# Altium project POWER.PRJPCB
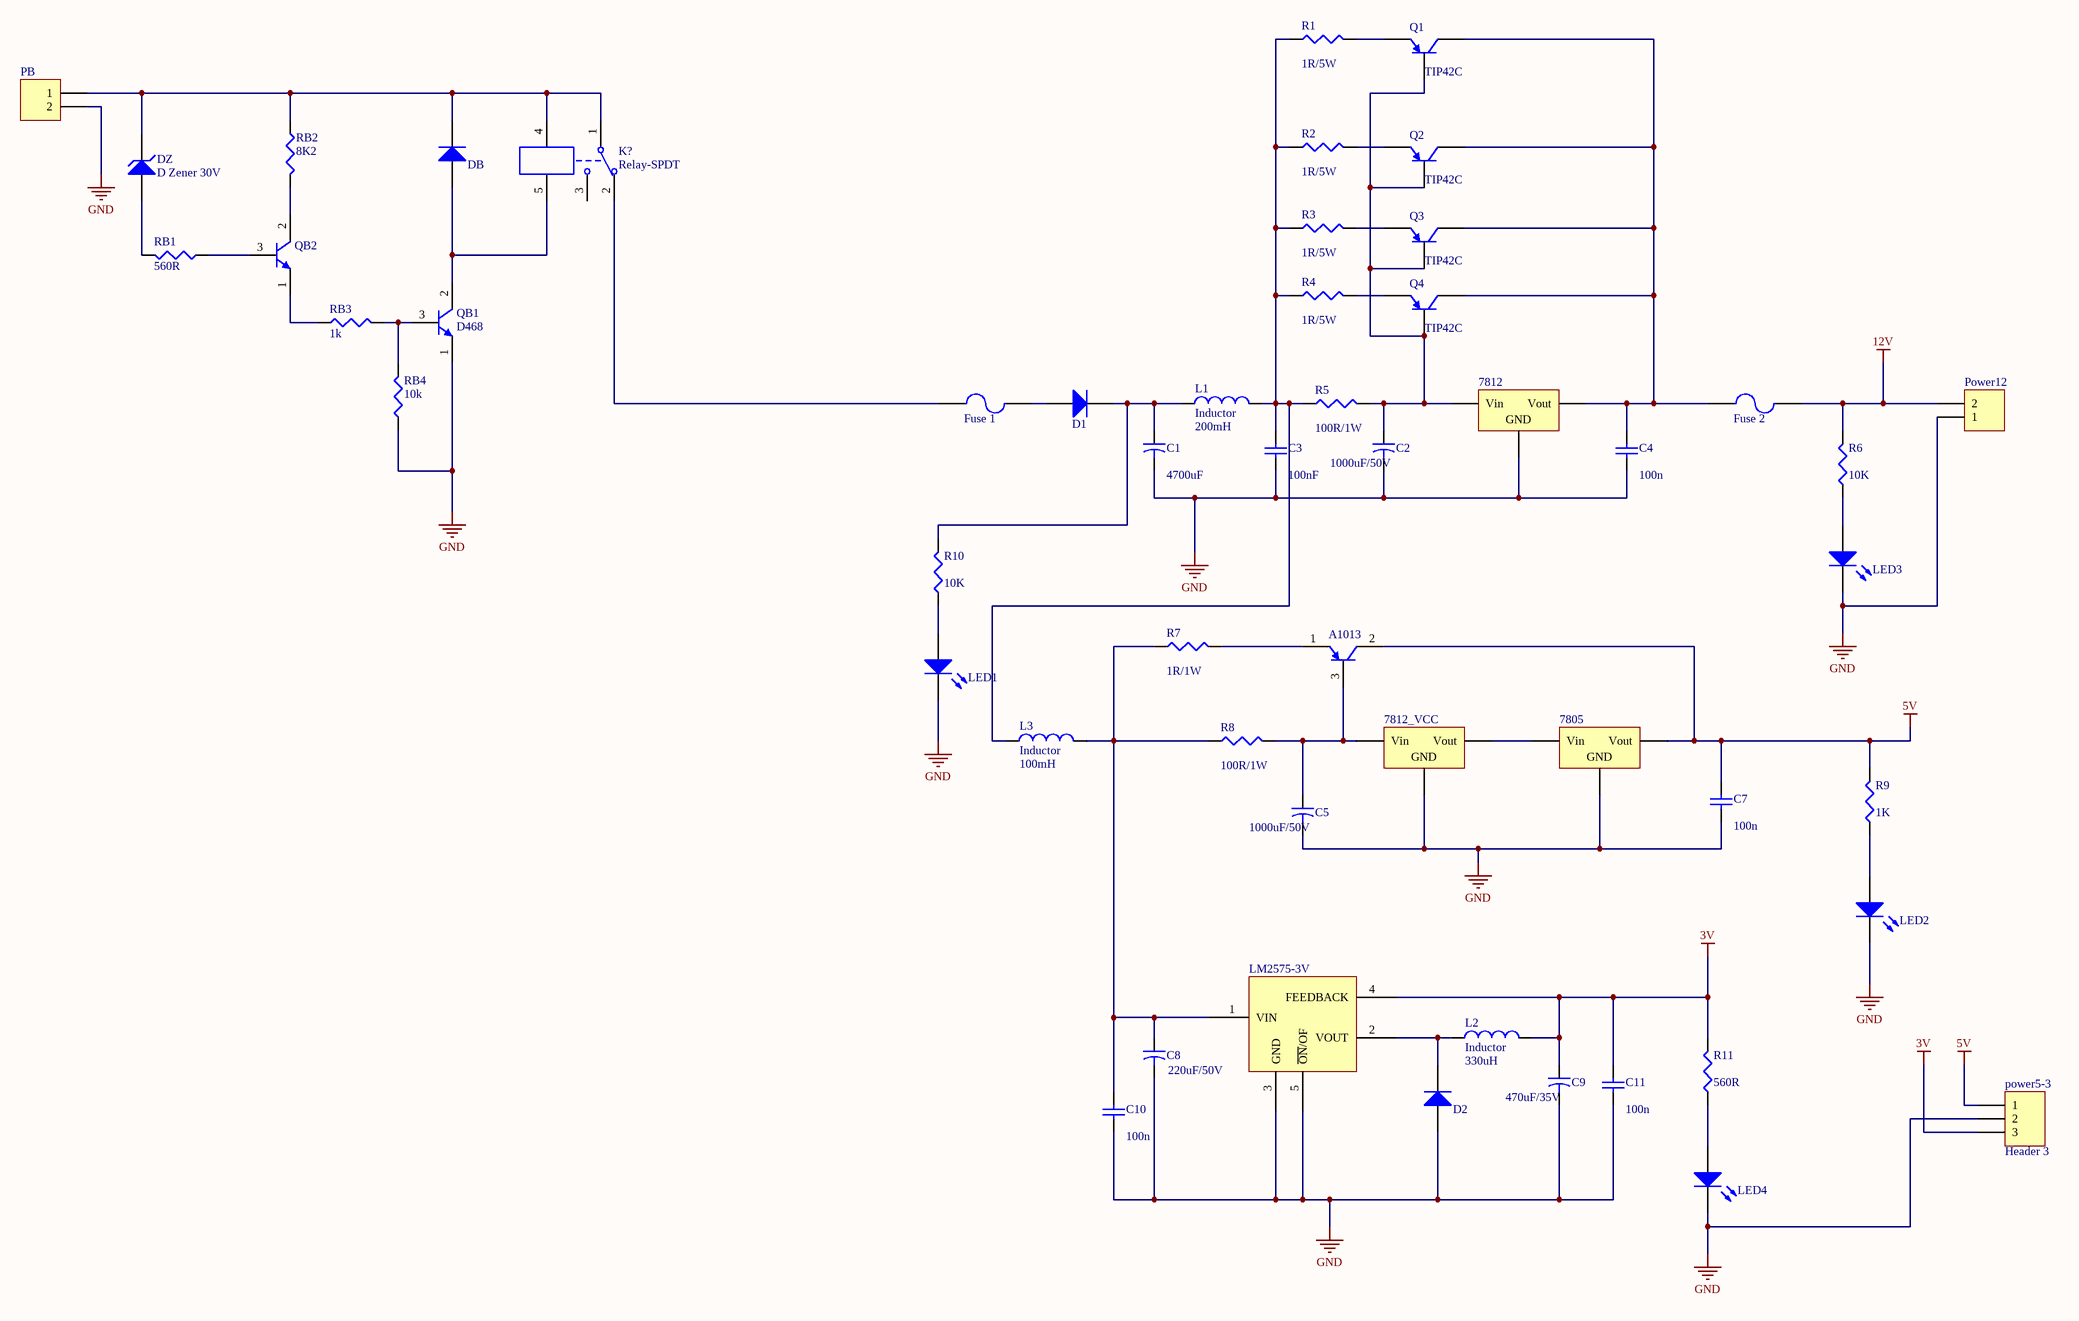
[diagram p0: power.SchDoc]
1 sheet, 53 parts. Net scope: global (net labels, ports and power ports of the same name join across sheets).
Board file: power.PcbDoc

## Sheet power.SchDoc
size A2

### Parts
7805  Volt Reg  [78xx]  (value not drawn)
7812  Volt Reg  [78xx_NO]  (value not drawn)
7812_VCC  Volt Reg  [78xx]  (value not drawn)
A1013  PNP  [D468/A1013]  (value not drawn)
C1  value 4700uF  [Tu 4700u/35V]  (hidden comment: Cap2)
C2  value 1000uF/50V  [Tu 1000u/50V]  (hidden comment: Cap2)
C3  value 100nF  [tu_gom]  (hidden comment: Cap Semi)
C4  value 100n  [tu_gom]  (hidden comment: Cap Semi)
C5  value 1000uF/50V  [Tu 1000u/50V]  (hidden comment: Cap2)
C7  value 100n  [tu_gom]  (hidden comment: Cap Semi)
C8  value 220uF/50V  [TU 220uF/50V]  (hidden comment: Cap2)
C9  value 470uF/35V  [TU 470uF/50V]  (hidden comment: Cap2)
C10  value 100n  [tu_gom]  (hidden comment: Cap Semi)
C11  value 100n  [tu_gom]  (hidden comment: Cap Semi)
D1  Diode  [D_10A]  (value not drawn)
D2  Diode  [D_1A]  (value not drawn)
DB  Diode  [D_1A]  (value not drawn)
DZ  D Zener 30V  [D_1A]
F1  Fuse 1  [FUSE_10A]
F2  Fuse 2  [FUSE_10A]
K?  Relay-SPDT  [Role 12V]
L1  Inductor  value 200mH  [Cuon cam to]
L2  Inductor  value 330uH  [R_Nor]
L3  Inductor  value 100mH  [Cuon cam nho]
LED1  LED  [LED_3]  (value not drawn)
LED2  LED  [LED_3]  (value not drawn)
LED3  LED  [LED_3]  (value not drawn)
LED4  LED  [LED_3]  (value not drawn)
LM2575-3V  LM2575-xx  [LM2575_3]  (value not drawn)
PB  Header 2  [Header_nguon_20A]  (value not drawn)
power5-3  Header 3  [HEADER3]
Power12  Header 2  [Header_nguon_20A]  (value not drawn)
Q1  TIP42C  [TIP42C]
Q2  TIP42C  [TIP42C]
Q3  TIP42C  [TIP42C]
Q4  TIP42C  [TIP42C]
QB1  D468  [D468/A1013]
QB2  2N3904  [C1815]  (value not drawn)
R1  value 1R/5W  [R_CS1R/5W]  (hidden comment: Res3)
R2  value 1R/5W  [R_CS1R/5W]  (hidden comment: Res3)
R3  value 1R/5W  [R_CS1R/5W]  (hidden comment: Res3)
R4  value 1R/5W  [R_CS1R/5W]  (hidden comment: Res3)
R5  value 100R/1W  [R_Nor]  (hidden comment: Res3)
R6  value 10K  [R_Nor]  (hidden comment: Res3)
R7  value 1R/1W  [R_Nor]  (hidden comment: Res3)
R8  value 100R/1W  [R_Nor]  (hidden comment: Res3)
R9  value 1K  [R_Nor]  (hidden comment: Res3)
R10  value 10K  [R_Nor]  (hidden comment: Res3)
R11  value 560R  [R_Nor]  (hidden comment: Res3)
RB1  value 560R  [R_Nor]  (hidden comment: Res3)
RB2  value 8K2  [R_Nor]  (hidden comment: Res3)
RB3  value 1k  [R_Nor]  (hidden comment: Res3)
RB4  value 10k  [R_Nor]  (hidden comment: Res3)

### Nets
3V: C9.1 C11.2 L2.2 LM2575-3V.4(FEEDBACK) power5-3.3 R11.2
5V: 7805.3(Vout) A1013.2(C) C7.2 power5-3.1 R9.2
12V: F2.2 Power12.2 R6.2
GND: 7805.2(GND) 7812.2(GND) 7812_VCC.2(GND) C1.2 C2.2 C3.1 C4.1 C5.2 C7.1 C8.2 C9.2 C10.1 C11.1 D2.1(A) LED1.2(K) LED2.2(K) LED3.2(K) LED4.2(K) LM2575-3V.3(GND) LM2575-3V.5(~{ON}/OF) PB.2 power5-3.2 Power12.1 QB1.1(E) RB4.1
Net7805_1: 7805.1(Vin) 7812_VCC.3(Vout)
Net7812_1: 7812.1(Vin) C2.1 Q1.1(B) Q2.1(B) Q3.1(B) Q4.1(B) R5.2
Net7812_3: 7812.3(Vout) C4.2 F2.1 Q1.2(C) Q2.2(C) Q3.2(C) Q4.2(C)
Net7812_VCC_1: 7812_VCC.1(Vin) A1013.3(B) C5.1 R8.2
NetA1013_1: A1013.1(E) R7.2
NetC1_1: C1.1 D1.2(K) L1.1 R10.2
NetC3_2: C3.2 L1.2 L3.1 R1.1 R2.1 R3.1 R4.1 R5.1
NetC8_1: C8.1 C10.2 L3.2 LM2575-3V.1(VIN) R7.1 R8.1
NetD1_1: D1.1(A) F1.2
NetD2_2: D2.2(K) L2.1 LM2575-3V.2(VOUT)
NetDB_1: DB.1(A) K?.5 QB1.2(C)
NetDB_2: DB.2(K) DZ.2(K) K?.1 K?.4 PB.1 RB2.1
NetDZ_1: DZ.1(A) RB1.2
NetF1_1: F1.1 K?.2
NetLED1_1: LED1.1(A) R10.1
NetLED2_1: LED2.1(A) R9.1
NetLED3_1: LED3.1(A) R6.1
NetLED4_1: LED4.1(A) R11.1
NetQ1_3: Q1.3(E) R1.2
NetQ2_3: Q2.3(E) R2.2
NetQ3_3: Q3.3(E) R3.2
NetQ4_3: Q4.3(E) R4.2
NetQB1_3: QB1.3(B) RB3.2 RB4.2
NetQB2_1: QB2.1(E) RB3.1
NetQB2_2: QB2.2(C) RB2.2
NetQB2_3: QB2.3(B) RB1.1

Not connected (* = marked no-connect by the designer): K? 3

### Library data of the parts
7805 7812 7812_VCC = Volt Reg: Voltage Regulator; Published: 24-Mar-1999; LatestRevisionDate: 17-Jul-2002; LatestRevisionNote: Re-released for DXP Platform.; PackageReference: D2PAK; Publisher: Altium Limited; Code_JEDEC: SMD-220
A1013 Q1-Q4 = PNP: PNP Bipolar Transistor; Published: 8-Jun-2000; LatestRevisionDate: 17-Jul-2002; LatestRevisionNote: Re-released for DXP Platform.; PackageReference: SOT-23B; Publisher: Altium Limited; Code_JEDEC: SOT-23
C1 C2 C5 C8 C9 = Cap2: Capacitor; Published: 23-Sep-2002; PackageReference: CAPR5-4X5; Publisher: Altium Limited
C3 C4 C7 C10 C11 = Cap Semi: Capacitor (Semiconductor SIM Model); Published: 8-Jun-2000; LatestRevisionDate: 17-Jul-2002; LatestRevisionNote: Re-released for DXP Platform.; PackageReference: C1206; Publisher: Altium Limited
DZ = D Zener: Zener Diode; Published: 8-Jun-2000; LatestRevisionDate: 17-Jul-2002; LatestRevisionNote: Re-released for DXP Platform.; PackageReference: DIODE-0.7; Publisher: Altium Limited
F1 F2 = Fuse 2: Fuse; Published: 8-Jun-2000; LatestRevisionDate: 17-Jul-2002; LatestRevisionNote: Re-released for DXP Platform.; PackageReference: PIN-W2/E2.8; Publisher: Altium Limited
K? = Relay-SPDT: Single-Pole Dual-Throw Relay; Published: 24-Mar-1999; LatestRevisionDate: 17-Jul-2002; LatestRevisionNote: Re-released for DXP Platform.; PackageReference: MODULE5B; Publisher: Altium Limited
L1-L3 = Inductor: Code_IEC: 1005; Published: 8-Jun-2000; LatestRevisionDate: 17-Jul-2002; LatestRevisionNote: Re-released for DXP Platform.; PackageReference: 0402-A; Publisher: Altium Limited; Code_JEITA: 0402
LM2575-3V = LM2575-3V
PB Power12 = Header 2: Header, 2-Pin; LatestRevisionDate: 17-Jul-2002; LatestRevisionNote: Re-released for DXP Platform.; Publisher: Altium Limited
power5-3 = Header 3: Header, 3-Pin; LatestRevisionDate: 17-Jul-2002; LatestRevisionNote: Re-released for DXP Platform.; Publisher: Altium Limited
QB1 = NPN: NPN Bipolar Transistor; Published: 8-Jun-2000; LatestRevisionDate: 17-Jul-2002; LatestRevisionNote: Re-released for DXP Platform.; PackageReference: TO-226; Publisher: Altium Limited; Code_JEDEC: TO-226-AA
QB2 = 2N3904: NPN General Purpose Amplifier; Published: 8-Jun-2000; LatestRevisionDate: 15-Jan-2003; LatestRevisionNote: PCB Footprint 'BCY-W3/D4.7' replaced; DatasheetDocument: 1997; PackageDocument: Sep-1998; PackageReference: TO-92A; Publisher: Altium Limited; Code_JEDEC: TO-92A; ComponentLink1Description: Manufacturer Link; ComponentLink1URL: http://www.fairchildsemi.com/; ComponentLink2Description: Datasheet; ComponentLink2URL: http://www.fairchildsemi.com/ds/2N%2F2N3904.pdf
R1-R11 RB1-RB4 = Res3: Resistor; Published: 8-Jun-2000; LatestRevisionDate: 04-Mar-2005; LatestRevisionNote: PCB Footprint replaced.; PackageReference: J1-0603; Publisher: Altium Limited